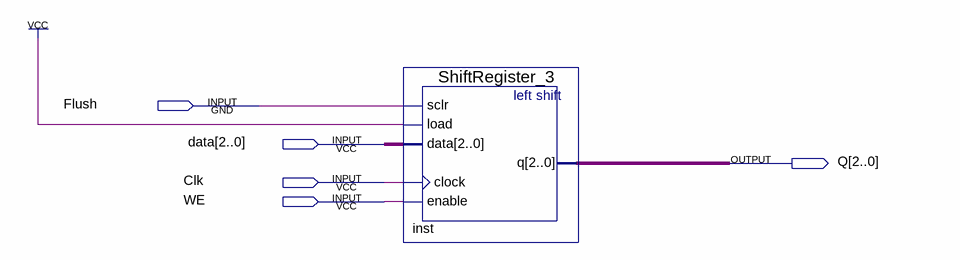
[diagram p0: schematic sheet]
// Quartus schematic ShiftRegister3.bdf as structural Verilog: 1 symbols, 5 pins
module ShiftRegister3 (
  input  Flush,
  input  [2:0] data,
  input  Clk,
  input  WE,
  output [2:0] Q
);

  ShiftRegister_3 inst (.sclr(Flush), .load(1'b1), .data(data), .clock(Clk), .enable(WE), .q(Q));
endmodule
